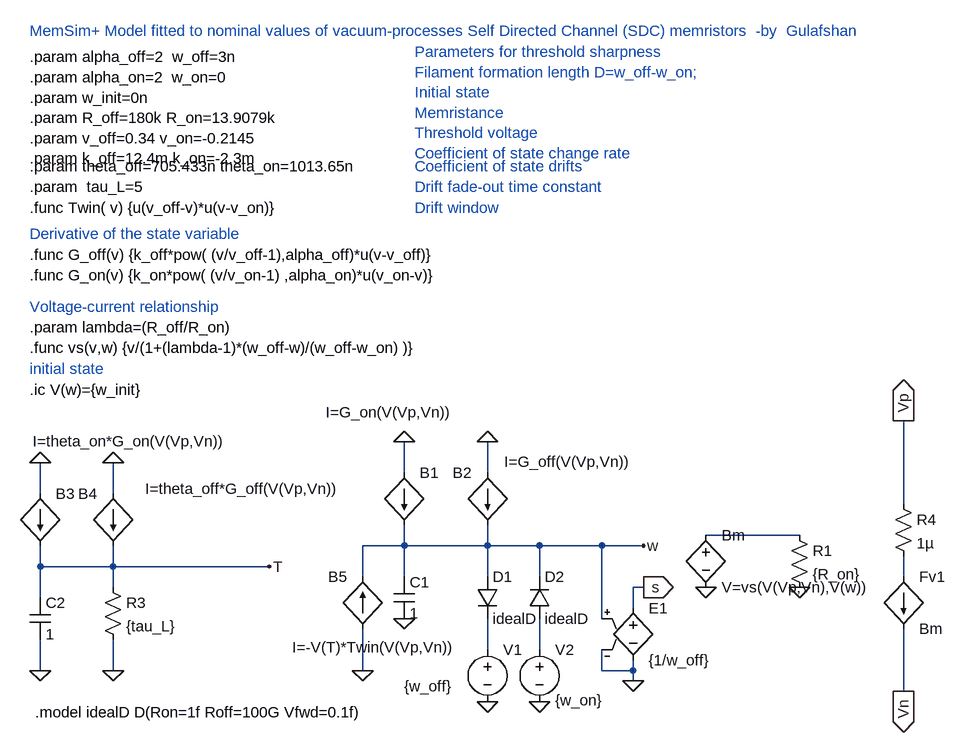
[diagram p0: schematic MemSim+SDC_nominal.asc]
MemSim+SDC_nominal.asc, the LTspice schematic file:
Version 4
SHEET 1 2968 1664
WIRE 800 336 800 288
WIRE 928 336 928 288
WIRE 240 368 240 320
WIRE 352 368 352 320
WIRE 1568 384 1568 256
WIRE 1408 432 1264 432
WIRE 800 448 800 416
WIRE 800 448 736 448
WIRE 928 448 928 416
WIRE 928 448 800 448
WIRE 1008 448 928 448
WIRE 1104 448 1008 448
WIRE 1168 448 1104 448
WIRE 240 480 240 448
WIRE 352 480 352 448
WIRE 352 480 240 480
WIRE 592 480 352 480
WIRE 736 496 736 448
WIRE 800 496 800 448
WIRE 928 496 928 448
WIRE 1008 496 1008 448
WIRE 1568 496 1568 464
WIRE 352 512 352 480
WIRE 1168 512 1152 512
WIRE 240 528 240 480
WIRE 1152 544 1152 512
WIRE 1104 560 1104 448
WIRE 928 608 928 560
WIRE 1008 608 1008 560
WIRE 240 640 240 592
WIRE 352 640 352 592
WIRE 736 640 736 576
WIRE 1104 640 1104 608
WIRE 1152 640 1152 624
WIRE 1152 640 1104 640
WIRE 1152 656 1152 640
WIRE 1568 672 1568 576
FLAG 800 288 0
FLAG 928 288 0
FLAG 800 560 0
FLAG 928 688 0
FLAG 1008 688 0
FLAG 1168 448 w
FLAG 1264 512 0
FLAG 1408 512 0
FLAG 1152 656 0
FLAG 1168 512 s
IOPIN 1168 512 Out
FLAG 240 640 0
FLAG 592 480 T
FLAG 240 320 0
FLAG 352 320 0
FLAG 352 640 0
FLAG 736 640 0
FLAG 1568 256 Vp
IOPIN 1568 256 Out
FLAG 1568 672 Vn
IOPIN 1568 672 Out
SYMBOL bi 800 336 R0
WINDOW 3 -121 -93 Left 2
SYMATTR Value I=G_on(V(Vp,Vn))
SYMATTR InstName B1
SYMBOL bi 928 336 M0
WINDOW 3 -220 -17 Left 2
SYMATTR Value I=G_off(V(Vp,Vn))
SYMATTR InstName B2
SYMBOL cap 784 496 R0
SYMATTR InstName C1
SYMATTR Value 1
SYMBOL diode 912 496 R0
SYMATTR InstName D1
SYMATTR Value idealD
SYMBOL diode 992 560 M180
WINDOW 0 24 64 Left 2
WINDOW 3 24 0 Left 2
SYMATTR InstName D2
SYMATTR Value idealD
SYMBOL voltage 928 592 R0
WINDOW 123 0 0 Left 2
WINDOW 39 0 0 Left 2
WINDOW 3 -128 72 Left 2
SYMATTR Value {w_off}
SYMATTR InstName V1
SYMBOL voltage 1008 592 R0
WINDOW 3 24 94 Left 2
WINDOW 123 0 0 Left 2
WINDOW 39 0 0 Left 2
SYMATTR Value {w_on}
SYMATTR InstName V2
SYMBOL res 1392 416 R0
SYMATTR InstName R1
SYMATTR Value {R_on}
SYMBOL bv 1264 416 R0
SYMATTR InstName Bm
SYMATTR Value V=vs(V(Vp,Vn),V(w))
SYMBOL e 1152 528 R0
SYMATTR InstName E1
SYMATTR Value {1/w_off}
SYMBOL cap 224 528 R0
SYMATTR InstName C2
SYMATTR Value 1
SYMBOL bi 240 368 R0
WINDOW 3 -12 -81 Left 2
SYMATTR Value I=theta_on*G_on(V(Vp,Vn))
SYMATTR InstName B3
SYMBOL bi 352 368 M0
WINDOW 3 -347 -8 Left 2
SYMATTR Value I=theta_off*G_off(V(Vp,Vn))
SYMATTR InstName B4
SYMBOL res 336 496 R0
SYMATTR InstName R3
SYMATTR Value {tau_L}
SYMBOL bi 736 576 R180
WINDOW 3 -142 -28 Left 2
WINDOW 0 24 80 Left 2
SYMATTR Value I=-V(T)*Twin(V(Vp,Vn))
SYMATTR InstName B5
SYMBOL f 1568 496 R0
SYMATTR InstName Fv1
SYMATTR Value Bm
SYMATTR Value2 -1
SYMBOL res 1552 368 R0
SYMATTR InstName R4
SYMATTR Value 1µ
TEXT 224 0 Left 2 !.func G_off(v) {k_off*pow( (v/v_off-1),alpha_off)*u(v-v_off)}
TEXT 224 32 Left 2 !.func G_on(v) {k_on*pow( (v/v_on-1) ,alpha_on)*u(v_on-v)}
TEXT 224 -32 Left 2 ;Derivative of the state variable
TEXT 232 704 Left 2 !.model idealD D(Ron=1f Roff=100G Vfwd=0.1f)
TEXT 224 -104 Left 2 !.param  tau_L=5
TEXT 224 -72 Left 2 !.func Twin( v) {u(v_off-v)*u(v-v_on)}
TEXT 224 -136 Left 2 !.param theta_off=705.433n theta_on=1013.65n
TEXT 224 -304 Left 2 !.param alpha_off=2  w_off=3n\n.param alpha_on=2  w_on=0\n.param w_init=0n\n.param R_off=180k R_on=13.9079k\n.param v_off=0.34 v_on=-0.2145\n.param k_off=12.4m k_on=-2.3m
TEXT 224 -344 Left 2 ;MemSim+ Model fitted to nominal values of vacuum-processes Self Directed Channel (SDC) memristors  -by  Gulafshan
TEXT 224 112 Left 2 !.param lambda=(R_off/R_on)\n.func vs(v,w) {v/(1+(lambda-1)*(w_off-w)/(w_off-w_on) )}
TEXT 224 80 Left 2 ;Voltage-current relationship
TEXT 224 176 Left 2 ;initial state
TEXT 224 208 Left 2 !.ic V(w)={w_init}
TEXT 816 -312 Left 2 ;Parameters for threshold sharpness\nFilament formation length D=w_off-w_on;\nInitial state \nMemristance\nThreshold voltage\nCoefficient of state change rate
TEXT 816 -136 Left 2 ;Coefficient of state drifts
TEXT 816 -104 Left 2 ;Drift fade-out time constant
TEXT 816 -72 Left 2 ;Drift window

The netlist it stands for:
* MemSim+SDC_nominal.asc
B1 0 w I=G_on(V(Vp,Vn))
B2 0 w I=G_off(V(Vp,Vn))
C1 w 0 1
D1 w N003 idealD
D2 N004 w idealD
V1 N003 0 {w_off}
V2 N004 0 {w_on}
R1 N001 0 {R_on}
Bm N001 0 V=vs(V(Vp,Vn),V(w))
E1 s 0 w 0 {1/w_off}
C2 T 0 1
B3 0 T I=theta_on*G_on(V(Vp,Vn))
B4 0 T I=theta_off*G_off(V(Vp,Vn))
R3 T 0 {tau_L}
B5 0 w I=-V(T)*Twin(V(Vp,Vn))
Fv1 N002 Vn Bm -1
R4 Vp N002 1µ
.model D D
.lib standard.dio
.func G_off(v) {k_off*pow( (v/v_off-1),alpha_off)*u(v-v_off)}
.func G_on(v) {k_on*pow( (v/v_on-1) ,alpha_on)*u(v_on-v)}
* Derivative of the state variable
.model idealD D(Ron=1f Roff=100G Vfwd=0.1f)
.param  tau_L=5
.func Twin( v) {u(v_off-v)*u(v-v_on)}
.param theta_off=705.433n theta_on=1013.65n
.param alpha_off=2  w_off=3n
.param alpha_on=2  w_on=0
.param w_init=0n
.param R_off=180k R_on=13.9079k
.param v_off=0.34 v_on=-0.2145
.param k_off=12.4m k_on=-2.3m
* MemSim+ Model fitted to nominal values of vacuum-processes Self Directed Channel (SDC) memristors  -by  Gulafshan
.param lambda=(R_off/R_on)
.func vs(v,w) {v/(1+(lambda-1)*(w_off-w)/(w_off-w_on) )}
* Voltage-current relationship
* initial state
.ic V(w)={w_init}
* Parameters for threshold sharpness
* Filament formation length D=w_off-w_on;
* Initial state
* Memristance
* Threshold voltage
* Coefficient of state change rate
* Coefficient of state drifts
* Drift fade-out time constant
* Drift window
.backanno
.end